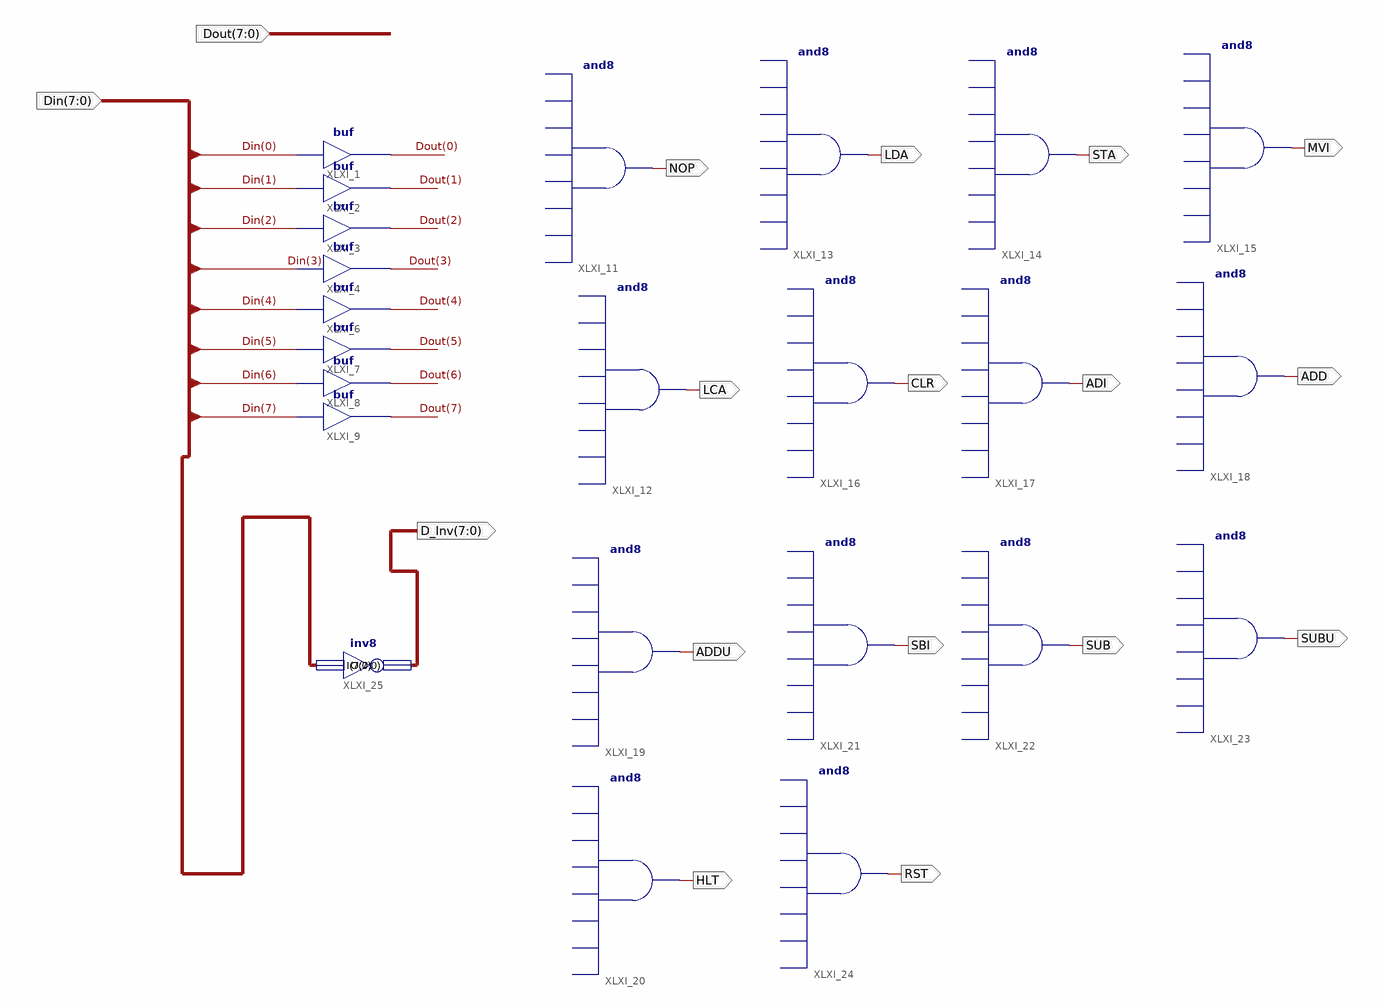
[diagram p0: schematic sheet 1]
// Xilinx ISE schematic InstructionSymbols.sch (spartan3e) as structural Verilog: 23 symbols, 17 ports
module InstructionSymbols (
  input  [7:0] Din,
  input  [7:0] Dout,
  output LCA,
  output CLR,
  output ADDU,
  output SBI,
  output HLT,
  output RST,
  output SUB,
  output SUBU,
  output ADI,
  output ADD,
  output MVI,
  output STA,
  output NOP,
  output LDA,
  output [7:0] D_Inv
);

  buf XLXI_1 (Dout[0], Din[0]);
  buf XLXI_2 (Dout[1], Din[1]);
  buf XLXI_3 (Dout[2], Din[2]);
  buf XLXI_4 (Dout[3], Din[3]);
  buf XLXI_6 (Dout[4], Din[4]);
  buf XLXI_7 (Dout[5], Din[5]);
  buf XLXI_8 (Dout[6], Din[6]);
  buf XLXI_9 (Dout[7], Din[7]);
  // and8 XLXI_12 has open pins: I0=open, I1=open, I2=open, I3=open, I4=open, I5=open, I6=open, I7=open, O=LCA
  // and8 XLXI_14 has open pins: I0=open, I1=open, I2=open, I3=open, I4=open, I5=open, I6=open, I7=open, O=STA
  // and8 XLXI_15 has open pins: I0=open, I1=open, I2=open, I3=open, I4=open, I5=open, I6=open, I7=open, O=MVI
  // and8 XLXI_16 has open pins: I0=open, I1=open, I2=open, I3=open, I4=open, I5=open, I6=open, I7=open, O=CLR
  // and8 XLXI_17 has open pins: I0=open, I1=open, I2=open, I3=open, I4=open, I5=open, I6=open, I7=open, O=ADI
  // and8 XLXI_18 has open pins: I0=open, I1=open, I2=open, I3=open, I4=open, I5=open, I6=open, I7=open, O=ADD
  // and8 XLXI_19 has open pins: I0=open, I1=open, I2=open, I3=open, I4=open, I5=open, I6=open, I7=open, O=ADDU
  // and8 XLXI_20 has open pins: I0=open, I1=open, I2=open, I3=open, I4=open, I5=open, I6=open, I7=open, O=HLT
  // and8 XLXI_21 has open pins: I0=open, I1=open, I2=open, I3=open, I4=open, I5=open, I6=open, I7=open, O=SBI
  // and8 XLXI_22 has open pins: I0=open, I1=open, I2=open, I3=open, I4=open, I5=open, I6=open, I7=open, O=SUB
  // and8 XLXI_23 has open pins: I0=open, I1=open, I2=open, I3=open, I4=open, I5=open, I6=open, I7=open, O=SUBU
  // and8 XLXI_24 has open pins: I0=open, I1=open, I2=open, I3=open, I4=open, I5=open, I6=open, I7=open, O=RST
  // and8 XLXI_11 has open pins: I0=open, I1=open, I2=open, I3=open, I4=open, I5=open, I6=open, I7=open, O=NOP
  // and8 XLXI_13 has open pins: I0=open, I1=open, I2=open, I3=open, I4=open, I5=open, I6=open, I7=open, O=LDA
  inv8 XLXI_25 (.I(Din), .O(D_Inv));
endmodule
